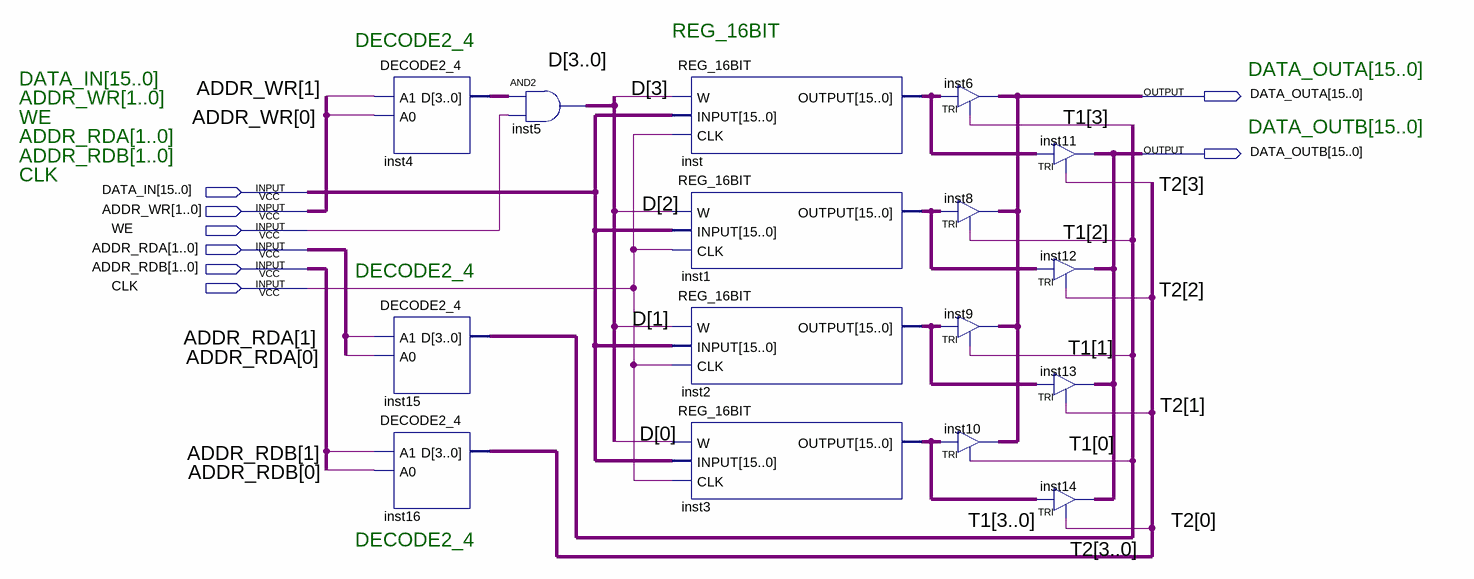
[diagram p0: schematic sheet]
// Quartus schematic REGFILE.bdf as structural Verilog: 16 symbols, 8 pins
module REGFILE (
  input  [15:0] DATA_IN,
  input  [1:0] ADDR_WR,
  input  WE,
  input  [1:0] ADDR_RDA,
  input  [1:0] ADDR_RDB,
  input  CLK,
  output [15:0] DATA_OUTA,
  output [15:0] DATA_OUTB
);

  wire [3:0] D, inst4_d, T1, T2;
  wire [15:0] inst1_output, inst2_output, inst3_output, inst_output;

  DECODE2_4 inst4 (.A1(ADDR_WR[1]), .A0(ADDR_WR[0]), .D(inst4_d));
  DECODE2_4 inst15 (.A1(ADDR_RDA[1]), .A0(ADDR_RDA[0]), .D(T1));
  DECODE2_4 inst16 (.A1(ADDR_RDB[1]), .A0(ADDR_RDB[0]), .D(T2));
  assign D = inst4_d & {4{WE}};  // AND2 inst5, 4 bits wide
  REG_16BIT inst (.W(D[3]), .INPUT(DATA_IN), .CLK(CLK), .OUTPUT(inst_output));
  REG_16BIT inst1 (.W(D[2]), .INPUT(DATA_IN), .CLK(CLK), .OUTPUT(inst1_output));
  REG_16BIT inst2 (.W(D[1]), .INPUT(DATA_IN), .CLK(CLK), .OUTPUT(inst2_output));
  REG_16BIT inst3 (.W(D[0]), .INPUT(DATA_IN), .CLK(CLK), .OUTPUT(inst3_output));
  TRI inst6[15:0] (.IN(inst_output), .OE(T1[3]), .OUT(DATA_OUTA));
  TRI inst8[15:0] (.IN(inst1_output), .OE(T1[2]), .OUT(DATA_OUTA));
  TRI inst9[15:0] (.IN(inst2_output), .OE(T1[1]), .OUT(DATA_OUTA));
  TRI inst10[15:0] (.IN(inst3_output), .OE(T1[0]), .OUT(DATA_OUTA));
  TRI inst11[15:0] (.IN(inst_output), .OE(T2[3]), .OUT(DATA_OUTB));
  TRI inst12[15:0] (.IN(inst1_output), .OE(T2[2]), .OUT(DATA_OUTB));
  TRI inst13[15:0] (.IN(inst2_output), .OE(T2[1]), .OUT(DATA_OUTB));
  TRI inst14[15:0] (.IN(inst3_output), .OE(T2[0]), .OUT(DATA_OUTB));

  // Notes on the sheet:
  //   REG_16BIT
  //   DECODE2_4
  //   DATA_OUTA[15..0]
  //   DATA_IN[15..0]
  //   ADDR_WR[1..0]
  //   WE
  //   DATA_OUTB[15..0]
  //   ADDR_RDA[1..0]
  //   ADDR_RDB[1..0]
  //   CLK
  //   DECODE2_4
  //   DECODE2_4
endmodule
